# EAGLE design mainBoard1 (EAGLE 7.6.0)
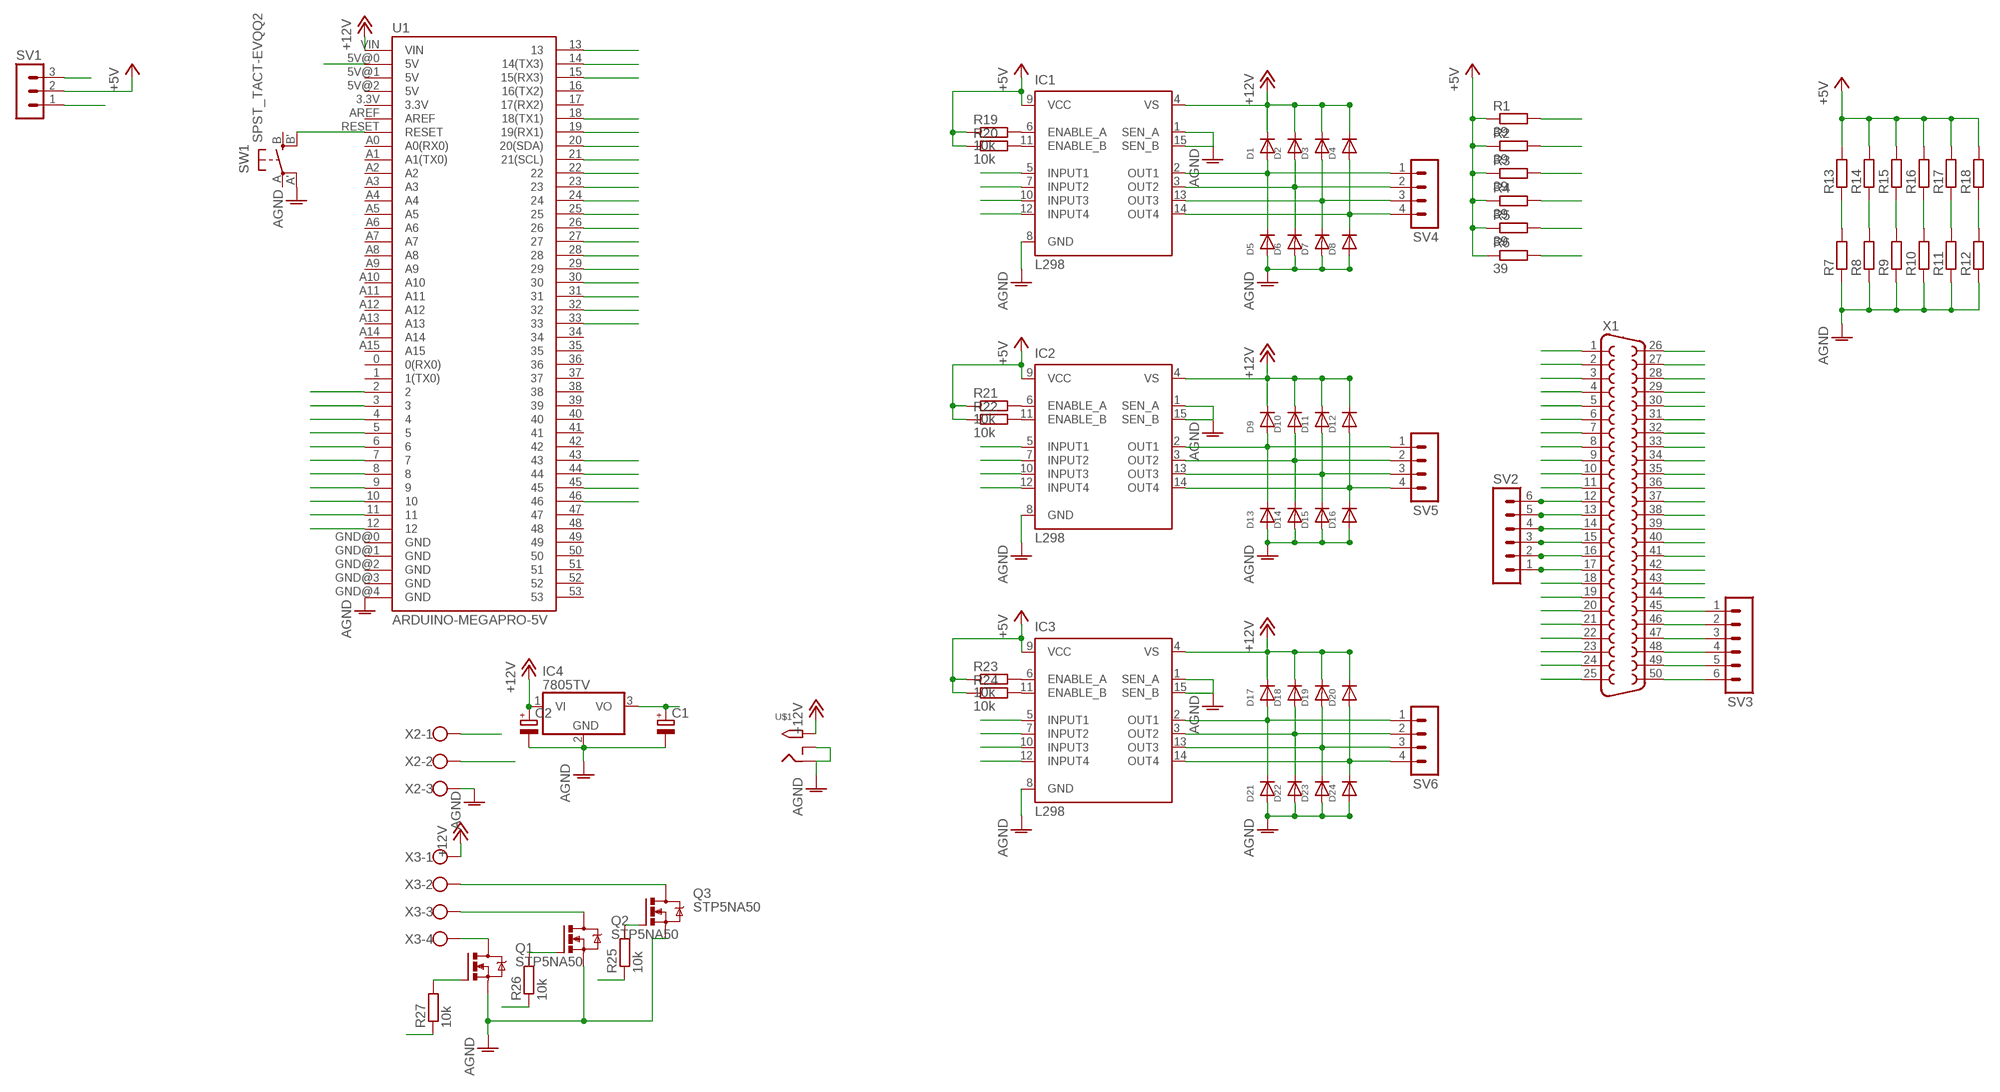
[diagram p0: schematic, sheet 1]

## Parts
C1  CPOL-EUE2,5-6E  [E2,5-6E]
C2  CPOL-EUE2,5-6E  [E2,5-6E]
D1  DIODESOD-323F  [SOD-323F]
D2  DIODESOD-323F  [SOD-323F]
D3  DIODESOD-323F  [SOD-323F]
D4  DIODESOD-323F  [SOD-323F]
D5  DIODESOD-323F  [SOD-323F]
D6  DIODESOD-323F  [SOD-323F]
D7  DIODESOD-323F  [SOD-323F]
D8  DIODESOD-323F  [SOD-323F]
D9  DIODESOD-323F  [SOD-323F]
D10  DIODESOD-323F  [SOD-323F]
D11  DIODESOD-323F  [SOD-323F]
D12  DIODESOD-323F  [SOD-323F]
D13  DIODESOD-323F  [SOD-323F]
D14  DIODESOD-323F  [SOD-323F]
D15  DIODESOD-323F  [SOD-323F]
D16  DIODESOD-323F  [SOD-323F]
D17  DIODESOD-323F  [SOD-323F]
D18  DIODESOD-323F  [SOD-323F]
D19  DIODESOD-323F  [SOD-323F]
D20  DIODESOD-323F  [SOD-323F]
D21  DIODESOD-323F  [SOD-323F]
D22  DIODESOD-323F  [SOD-323F]
D23  DIODESOD-323F  [SOD-323F]
D24  DIODESOD-323F  [SOD-323F]
IC1  L298  [MULTIWATT-15]
IC2  L298  [MULTIWATT-15]
IC3  L298  [MULTIWATT-15]
IC4  7805TV  [TO220V]
Q1  STP5NA50  [TO220BV]
Q2  STP5NA50  [TO220BV]
Q3  STP5NA50  [TO220BV]
R1  39  R0207/10  [0207/10]
R2  39  R0207/10  [0207/10]
R3  39  R0207/10  [0207/10]
R4  39  R0207/10  [0207/10]
R5  39  R0207/10  [0207/10]
R6  39  R0207/10  [0207/10]
R7  R0207/10  [0207/10]
R8  R0207/10  [0207/10]
R9  R0207/10  [0207/10]
R10  R0207/10  [0207/10]
R11  R0207/10  [0207/10]
R12  R0207/10  [0207/10]
R13  R0207/10  [0207/10]
R14  R0207/10  [0207/10]
R15  R0207/10  [0207/10]
R16  R0207/10  [0207/10]
R17  R0207/10  [0207/10]
R18  R0207/10  [0207/10]
R19  10k  R-EU_R0805  [R0805]
R20  10k  R-EU_R0805  [R0805]
R21  10k  R-EU_R0805  [R0805]
R22  10k  R-EU_R0805  [R0805]
R23  10k  R-EU_R0805  [R0805]
R24  10k  R-EU_R0805  [R0805]
R25  10k  R-EU_R0805  [R0805]
R26  10k  R-EU_R0805  [R0805]
R27  10k  R-EU_R0805  [R0805]
SV1  MA03-1  [MA03-1]
SV2  MA06-1  [MA06-1]
SV3  MA06-1  [MA06-1]
SV4  MA04-1  [MA04-1]
SV5  MA04-1  [MA04-1]
SV6  MA04-1  [MA04-1]
SW1  SPST_TACT-EVQQ2  [EVQ-Q2]
U1  ARDUINO-MEGAPRO-5V  [ARDUINO_MEGA-PRO-5V]
U$1  2.1MMJACKTHM  [PJ-102A]
X1  F50VP  [F50VP]
X2  W237-103  [W237-103]
X3  W237-4  [W237-4]

## Nets
5V_ARD: SV1.3 U1.5V@0(5V)
5V_REG: C1.+ IC4.3(VO) SV1.1 X2.1
+5V: IC1.9(VCC) IC2.9(VCC) IC3.9(VCC) R1.1 R2.1 R3.1 R4.1 R5.1 R6.1 R13.2 R14.2 R15.2 R16.2 R17.2 R18.2 R19.1 R20.1 R21.1 R22.1 R23.1 R24.1 SV1.2
+12V: C2.+ D1.C D2.C D3.C D4.C D9.C D10.C D11.C D12.C D17.C D18.C D19.C D20.C IC1.4(VS) IC2.4(VS) IC3.4(VS) IC4.1(VI) U1.VIN U$1.TIP X3.1
AGND: C1.- C2.- D5.A D6.A D7.A D8.A D13.A D14.A D15.A D16.A D21.A D22.A D23.A D24.A IC1.1(SEN_A) IC1.8(GND) IC1.15(SEN_B) IC2.1(SEN_A) IC2.8(GND) IC2.15(SEN_B) IC3.1(SEN_A) IC3.8(GND) IC3.15(SEN_B) IC4.2(GND) Q1.S Q2.S Q3.S R7.1 R8.1 R9.1 R10.1 R11.1 R12.1 SW1.A'(P1) U1.GND@4(GND) U$1.RING U$1.RING_SW X1.28 X1.29 X1.30 X1.31 X1.32 X1.33 X2.3
LED_0: R1.2 X1.11
LED_1: R2.2 X1.27
LED_2: R3.2 X1.10
LED_3: R4.2 X1.26
LED_4: R5.2 X1.9
LED_5: R6.2 X1.25
LED_B: R27.1 U1.46
LED_DATA: U1.43 X2.2
LED_G: R26.1 U1.45
LED_R: R25.1 U1.44
M1_0: D1.A D5.C IC1.2(OUT1) SV3.6 SV4.1 X1.50
M1_0_IN: IC1.5(INPUT1) U1.14(14(TX3))
M1_1: D3.A D7.C IC1.13(OUT3) SV3.5 SV4.3 X1.49
M1_1_IN: IC1.10(INPUT3) U1.4
M1_2: D9.A D13.C IC2.2(OUT1) SV3.4 SV5.1 X1.48
M1_2_IN: IC2.5(INPUT1) U1.6
M1_3: D11.A D15.C IC2.13(OUT3) SV3.3 SV5.3 X1.47
M1_3_IN: IC2.10(INPUT3) U1.8
M1_4: D17.A D21.C IC3.2(OUT1) SV3.2 SV6.1 X1.46
M1_4_IN: IC3.5(INPUT1) U1.10
M1_5: D19.A D23.C IC3.13(OUT3) SV3.1 SV6.3 X1.45
M1_5_IN: IC3.10(INPUT3) U1.12
M2_0: D2.A D6.C IC1.3(OUT2) SV2.1 SV4.2 X1.17
M2_0_IN: IC1.7(INPUT2) U1.15(15(RX3))
M2_1: D4.A D8.C IC1.14(OUT4) SV2.2 SV4.4 X1.16
M2_1_IN: IC1.12(INPUT4) U1.5
M2_2: D10.A D14.C IC2.3(OUT2) SV2.3 SV5.2 X1.15
M2_2_IN: IC2.7(INPUT2) U1.7
M2_3: D12.A D16.C IC2.14(OUT4) SV2.4 SV5.4 X1.14
M2_3_IN: IC2.12(INPUT4) U1.9
M2_4: D18.A D22.C IC3.3(OUT2) SV2.5 SV6.2 X1.13
M2_4_IN: IC3.7(INPUT2) U1.11
M2_5: D20.A D24.C IC3.14(OUT4) SV2.6 SV6.4 X1.12
M2_5_IN: IC3.12(INPUT4) U1.13
MS_0: R7.2 R13.1 U1.2 X1.23
MS_1: R8.2 R14.1 U1.3 X1.7
MS_2: R9.2 R15.1 U1.21(21(SCL)) X1.24
MS_3: R10.2 R16.1 U1.20(20(SDA)) X1.8
MS_4: R11.2 R17.1 U1.19(19(RX1)) X1.6
MS_5: R12.2 R18.1 U1.18(18(TX1)) X1.22
N$1: Q1.D X3.4
N$2: Q3.D X3.2
N$3: Q2.D X3.3
N$5: IC1.6(ENABLE_A) R19.2
N$6: IC1.11(ENABLE_B) R20.2
N$7: Q3.G R25.2
N$8: Q2.G R26.2
N$9: Q1.G R27.2
N$11: IC2.6(ENABLE_A) R21.2
N$12: IC2.11(ENABLE_B) R22.2
N$17: IC3.6(ENABLE_A) R23.2
N$18: IC3.11(ENABLE_B) R24.2
N$27: SW1.B'(S1) U1.RESET
N$44: X1.37
N$45: X1.38
N$46: X1.39
N$47: X1.40
N$48: X1.41
N$49: X1.42
N$50: X1.43
N$51: X1.44
P0_0: U1.22 X1.2
P0_1: U1.24 X1.1
P0_2: U1.26 X1.36
P0_3: U1.28 X1.35
P0_4: U1.30 X1.18
P0_5: U1.32 X1.34
P1_0: U1.23 X1.5
P1_1: U1.25 X1.21
P1_2: U1.27 X1.4
P1_3: U1.29 X1.20
P1_4: U1.31 X1.3
P1_5: U1.33 X1.19
Unconnected: SW1.A(P) SW1.B(S) U1.0(0(RX0)) U1.1(1(TX0)) U1.3.3V U1.5V@1(5V) U1.5V@2(5V) U1.16(16(TX2)) U1.17(17(RX2)) U1.34 U1.35 U1.36 U1.37 U1.38 U1.39 U1.40 U1.41 U1.42 U1.47 U1.48 U1.49 U1.50 U1.51 U1.52 U1.53 U1.A0(A0(RX0)) U1.A1(A1(TX0)) U1.A2 U1.A3 U1.A4 U1.A5 U1.A6 U1.A7 U1.A8 U1.A9 U1.A10 U1.A11 U1.A12 U1.A13 U1.A14 U1.A15 U1.AREF U1.GND@0(GND) U1.GND@1(GND) U1.GND@2(GND) U1.GND@3(GND)

## Library data of the parts
C1 C2 = rcl:CPOL-EU: POLARIZED CAPACITOR, European symbol
D1-D24 = adafruit:DIODE: Diode SMADIODE - SMA Surface Mount Package 20V 1A Schottky Diode Digikey: 641-1014-6-ND DO-1N4148 - Through Hole Small Current Diode SOD-123 20V 1 A (.5mV Vf) Schottky Diode - Digikey: MBRX120TPMSCT-ND SOD-323 10V 570mA (.38mV Vf, 3ns) Schottky Diode - Digikey: ZLLS410CT-ND SOD-523 30V 30mA Schottky Diode (RB751S-40TE61) - Digikey: RB751S-40TE61CT-ND SOT23-R/W - SOT23 Package (R = Solder Paste/Reflow Ovens, W = Hand-Soldering) BAT54Film 40V 300mA - Digikey: 497-7162-1-ND
IC1-IC3 = st-microelectronics:L298: DUAL FULL-BRIDGE DRIVER; MPN: L298N; OC_FARNELL: 1589425; OC_NEWARK: 32M1527
IC4 = linear:78*: Positive VOLTAGE REGULATOR Source: http://cache.national.com/ds/LM/LM78L05.pdf http://www.fairchildsemi.com/ds/LM/LM7805.pdf
Q1-Q3 = transistor-power:STP5NA50: N-CHANNEL MOS FET
R1-R18 = eagle-ltspice:R: RESISTOR, European symbol; SPICEMODEL: NONE; SPICEPREFIX: R
R19-R27 = rcl:R-EU_: RESISTOR, European symbol
SV1 = con-lstb:MA03-1: PIN HEADER; OC_FARNELL: unknown; OC_NEWARK: unknown
SV2 SV3 = con-lstb:MA06-1: PIN HEADER; OC_FARNELL: unknown; OC_NEWARK: unknown
SV4-SV6 = con-lstb:MA04-1: PIN HEADER; OC_FARNELL: unknown; OC_NEWARK: unknown
SW1 = adafruit:SPST_TACT: SMT 6mm switch, EVQQ2 series http://www.ladyada.net/library/eagle
U1 = SparkFun-Boards:ARDUINO-MEGA: Arduino Mega board footprint
U$1 = adafruit:2.1MMJACK: 2.1mm x 5.5mm THM DC jack with internal switch. Digikey part #PJ-102A, 4UCON part #05537 2.1mm x 5.5mm SMT DC jack with internal switch. Digikey part #PJ-002A-SMT, 4UCON part #03267 By microbuilder.eu & adafruit.com
X1 = con-subd:F50: SUB-D; OC_FARNELL: unknown; OC_NEWARK: unknown
X2 = con-wago-500:W237-103: WAGO SCREW CLAMP; MPN: 237-103; OC_FARNELL: unknown; OC_NEWARK: 18M7116
X3 = con-wago-500:W237-4: WAGO SCREW CLAMP; OC_FARNELL: unknown; OC_NEWARK: unknown

## Board
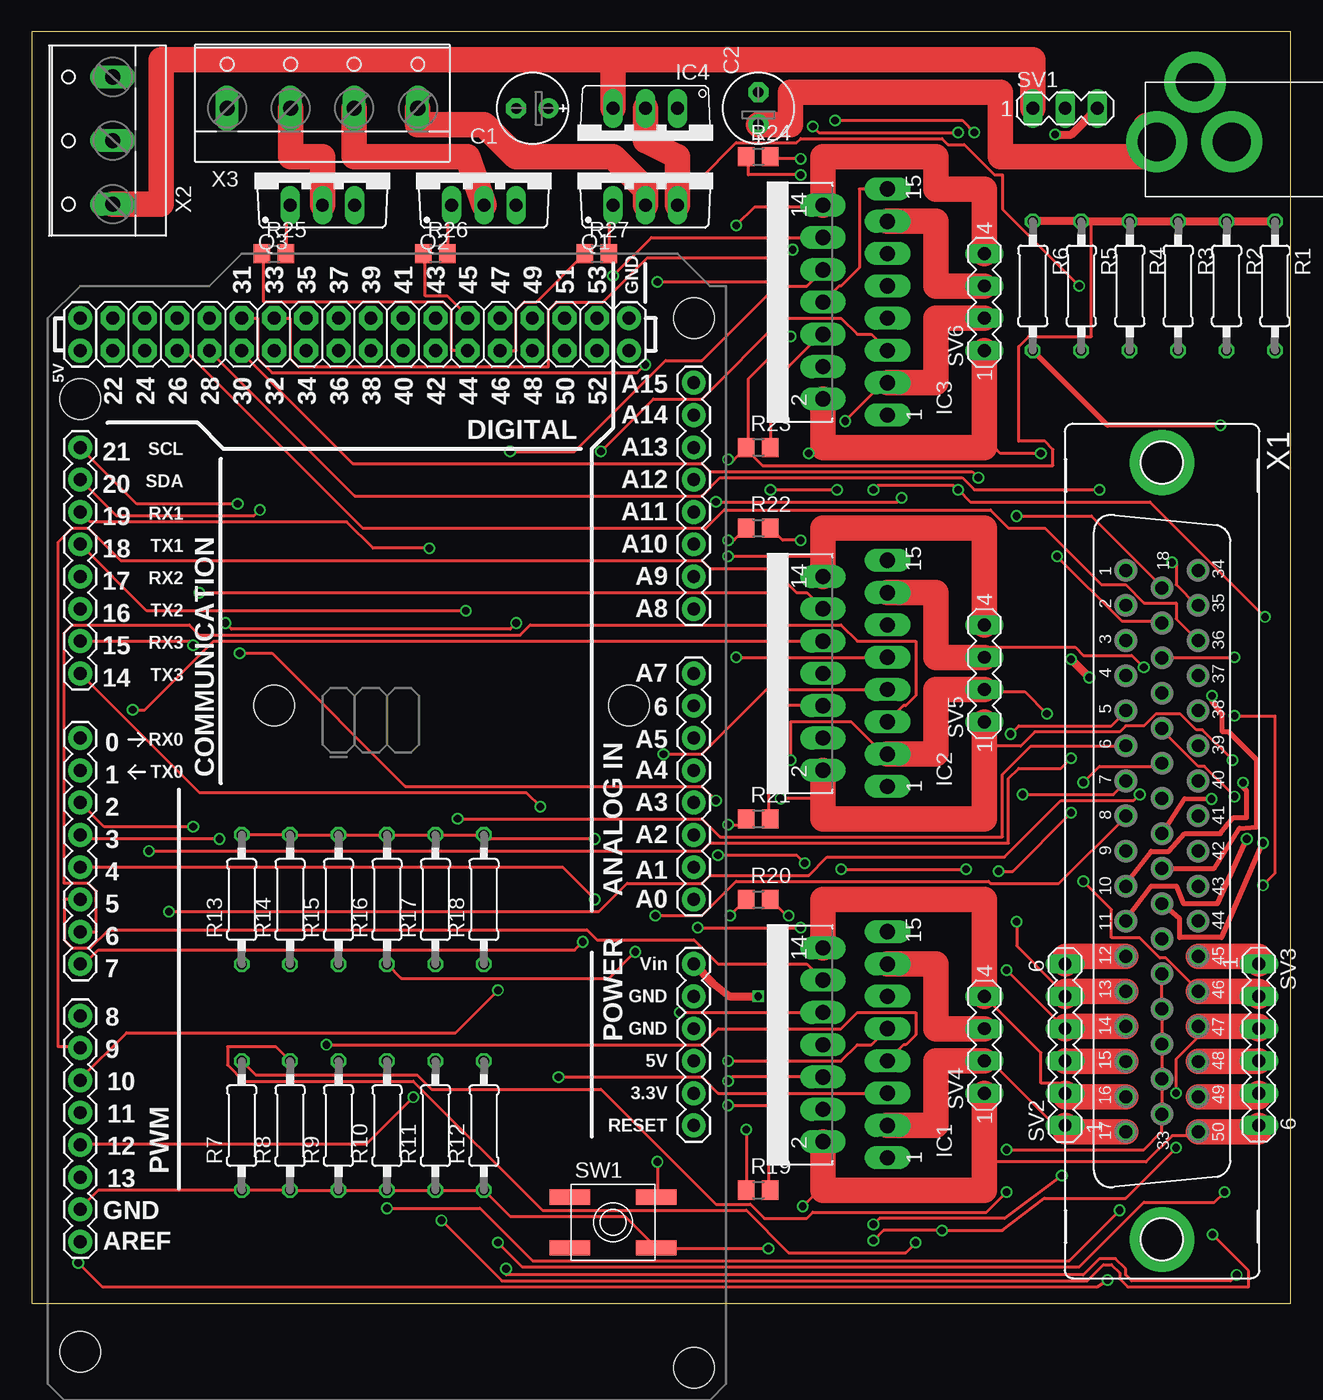
[diagram p1: board, top side]
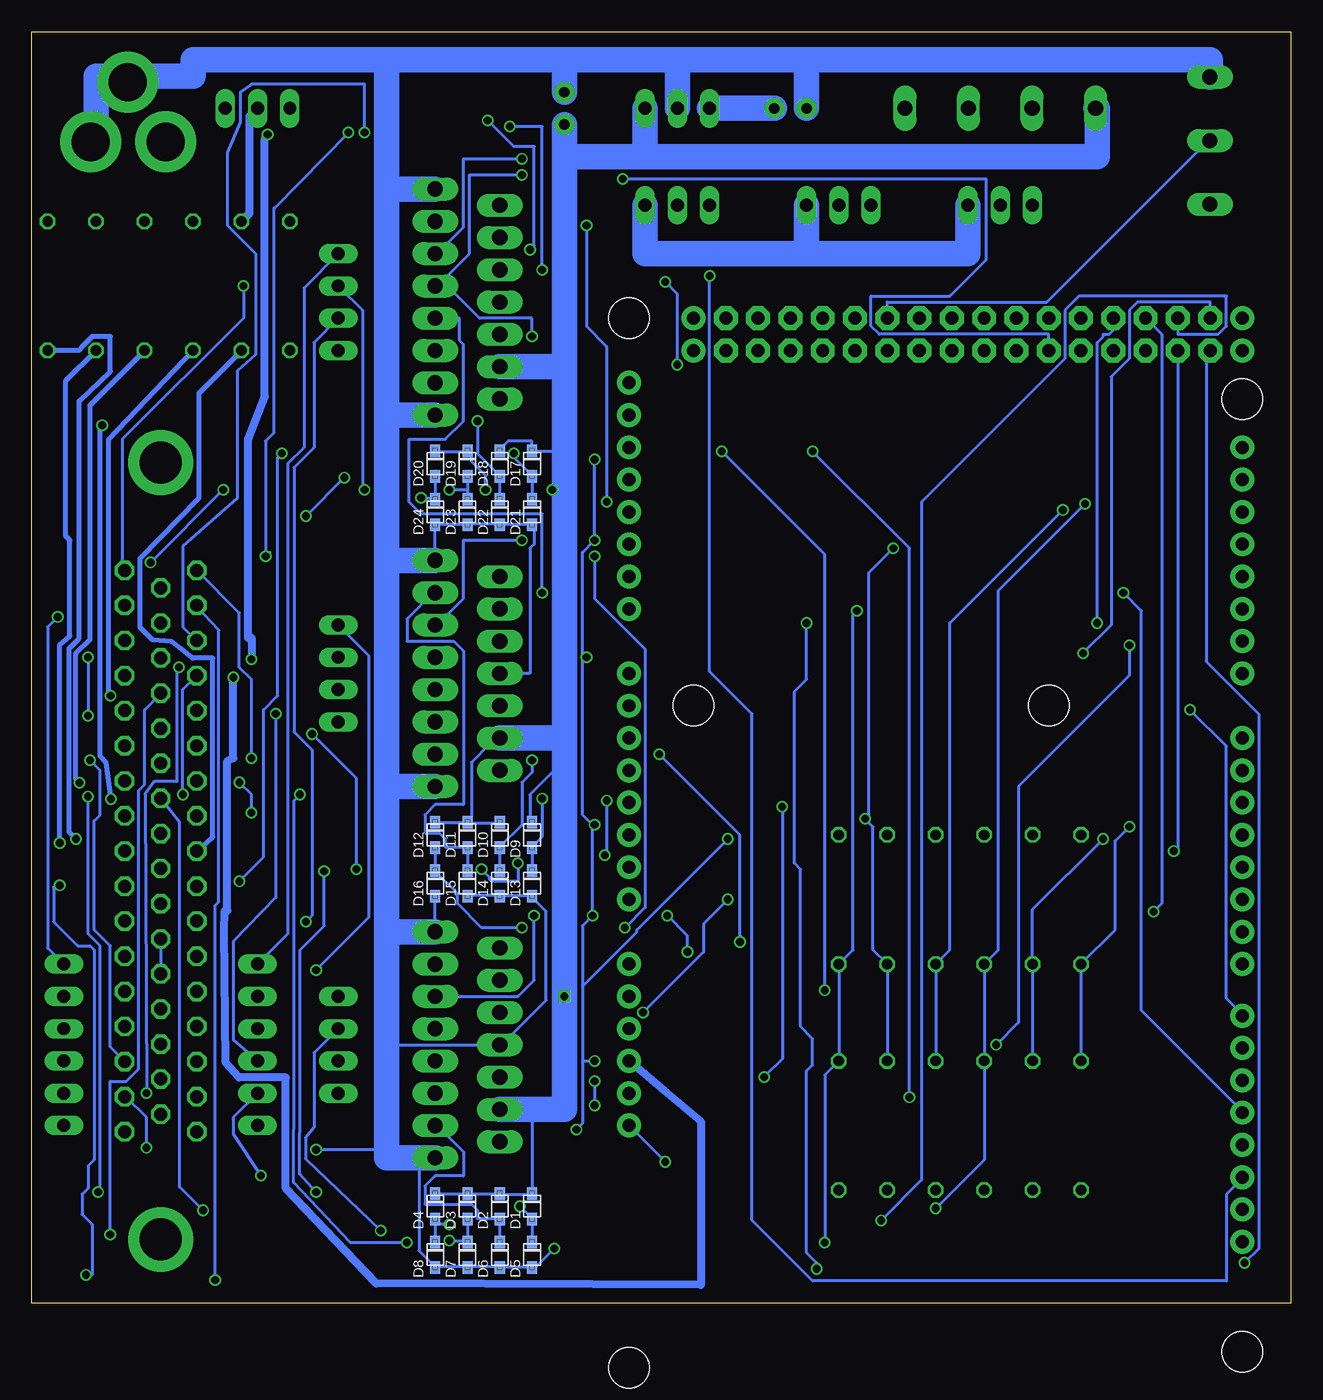
[diagram p2: board, bottom side, seen from below]

Size 99.04 x 100 mm. Coordinates in mm from the lower left corner, seen from the top.
Outline: 0,0 99.04,0 99.04,100 0,100 0,0
Copper layers (1*16): Top 0.035mm / dielectric 1.6mm / Bottom 0.035mm
Design rules "Elecrow_2-layer_PCB_eagle_rule": minimum track width 6mil, minimum drill 12mil, track to track 6mil, track to pad 6mil, pad to pad 6mil, via to via 8mil, smd to smd 0mil, copper to edge 20mil, drill to drill 10mil, minimum pad ring 6mil, minimum via ring 6mil, stop-mask expansion 0mil, vias tented up to drill 100mil, thermal gap 10mil

### Footprints (pad centres in the part's own frame; a part is rotated, then mirrored left to right if it is on the bottom)
E2,5-6E = drill 0.813 pad 1.575: + -1.27,0 | drill 0.813 pad 1.575 octagon: - 1.27,0
SOD-323F = smd 1 x 0.8: A -1,0; C 1,0
MULTIWATT-15 = drill 1.2 long: 1 -8.89,-7.62; 2 -7.62,-2.54; 3 -6.35,-7.62; 4 -5.08,-2.54; 5 -3.81,-7.62; 6 -2.54,-2.54; 7 -1.27,-7.62; 8 0,-2.54; 9 1.27,-7.62; 10 2.54,-2.54; 11 3.81,-7.62; 12 5.08,-2.54; 13 6.35,-7.62; 14 7.62,-2.54; 15 8.89,-7.62
TO220V = drill 1.016 long: 1 -2.54,-2.54; 2 0,-2.54; 3 2.54,-2.54
TO220BV = drill 1.016 long: D 0,-2.54; G -2.54,-2.54; S 2.54,-2.54
0207/10 = drill 0.813 octagon: 1 -5.08,0; 2 5.08,0
R0805 = smd 1.3 x 1.5: 1 -0.95,0; 2 0.95,0
MA03-1 = drill 1.016 long: 1 -2.54,0; 2 0,0; 3 2.54,0
MA06-1 = drill 1.016 long: 1 -6.35,0; 2 -3.81,0; 3 -1.27,0; 4 1.27,0; 5 3.81,0; 6 6.35,0
MA04-1 = drill 1.016 long: 1 -3.81,0; 2 -1.27,0; 3 1.27,0; 4 3.81,0
EVQ-Q2 = smd 3.2 x 1.2: A -3.4,-2; A' 3.4,-2; B -3.4,2; B' 3.4,2
ARDUINO_MEGA-PRO-5V = drill 1.016 pad 1.88: 0 52.07,50.8; 1 49.53,50.8; 2 46.99,50.8; 3 44.45,50.8; 3.3V 24.13,2.54; 4 41.91,50.8; 5 39.37,50.8; 5V@0 26.67,2.54; 5V@1 82.55,50.8; 5V@2 85.09,50.8; 6 36.83,50.8; 7 34.29,50.8; 8 30.226,50.8; 9 27.686,50.8; 10 25.146,50.8; 11 22.606,50.8; 12 20.066,50.8; 13 17.526,50.8; 14 57.15,50.8; 15 59.69,50.8; 16 62.23,50.8; 17 64.77,50.8; 18 67.31,50.8; 19 69.85,50.8; 20 72.39,50.8; 21 74.93,50.8; A0 39.37,2.54; A1 41.91,2.54; A2 44.45,2.54; A3 46.99,2.54; A4 49.53,2.54; A5 52.07,2.54; A6 54.61,2.54; A7 57.15,2.54; A8 62.23,2.54; A9 64.77,2.54; A10 67.31,2.54; A11 69.85,2.54; A12 72.39,2.54; A13 74.93,2.54; A14 77.47,2.54; A15 80.01,2.54; AREF 12.446,50.8; GND@0 29.21,2.54; GND@1 31.75,2.54; GND@2 82.55,7.62; GND@3 85.09,7.62; GND@4 14.986,50.8; RESET 21.59,2.54; VIN 34.29,2.54 | drill 1.016 pad 1.88 octagon: 22 82.55,48.26; 23 85.09,48.26; 24 82.55,45.72; 25 85.09,45.72; 26 82.55,43.18; 27 85.09,43.18; 28 82.55,40.64; 29 85.09,40.64; 30 82.55,38.1; 31 85.09,38.1; 32 82.55,35.56; 33 85.09,35.56; 34 82.55,33.02; 35 85.09,33.02; 36 82.55,30.48; 37 85.09,30.48; 38 82.55,27.94; 39 85.09,27.94; 40 82.55,25.4; 41 85.09,25.4; 42 82.55,22.86; 43 85.09,22.86; 44 82.55,20.32; 45 85.09,20.32; 46 82.55,17.78; 47 85.09,17.78; 48 82.55,15.24; 49 85.09,15.24; 50 82.55,12.7; 51 85.09,12.7; 52 82.55,10.16; 53 85.09,10.16 | hole 3.2: 3.81,50.8; 2.54,2.54; 54.61,35.56; 54.61,7.62; 78.74,50.8; 85.09,2.54
PJ-102A = drill 3 pad 4.8: RING 0.1,-3.39; RING_SW -4.6,-6.29; TIP 0.1,-9.29
F50VP = drill 1.016 octagon: 1 -22.073,-2.845; 2 -19.329,-2.845; 3 -16.561,-2.845; 4 -13.792,-2.845; 5 -11.049,-2.845; 6 -8.28,-2.845; 7 -5.512,-2.845; 8 -2.769,-2.845; 9 0,-2.845; 10 2.769,-2.845; 11 5.512,-2.845; 12 8.28,-2.845; 13 11.049,-2.845; 14 13.792,-2.845; 15 16.561,-2.845; 16 19.329,-2.845; 17 22.073,-2.845; 18 -20.701,0; 19 -17.932,0; 20 -15.189,0; 21 -12.421,0; 22 -9.652,0; 23 -6.909,0; 24 -4.14,0; 25 -1.372,0; 26 1.372,0; 27 4.14,0; 28 6.909,0; 29 9.652,0; 30 12.421,0; 31 15.189,0; 32 17.932,0; 33 20.701,0; 34 -22.073,2.845; 35 -19.329,2.845; 36 -16.561,2.845; 37 -13.792,2.845; 38 -11.049,2.845; 39 -8.28,2.845; 40 -5.512,2.845; 41 -2.769,2.845; 42 0,2.845; 43 2.769,2.845; 44 5.512,2.845; 45 8.28,2.845; 46 11.049,2.845; 47 13.792,2.845; 48 16.561,2.845; 49 19.329,2.845; 50 22.073,2.845 | drill 3.302 pad 5.08: G1 30.556,0; G2 -30.556,0
W237-103 = drill 1.194 long: 1 -5,-1.29; 2 0,-1.29; 3 5,-1.29
W237-4 = drill 1.194 long: 1 -7.5,-1.27; 2 -2.5,-1.27; 3 2.5,-1.27; 4 7.5,-1.27

### Placement (x,y rotation side)
C1  39.37,93.98 180 top
C2  57.15,93.98 90 top
D1  59.69,7.62 90 bottom
D2  62.23,7.62 90 bottom
D3  64.77,7.62 90 bottom
D4  67.31,7.62 90 bottom
D5  59.69,3.81 90 bottom
D6  62.23,3.81 90 bottom
D7  64.77,3.81 90 bottom
D8  67.31,3.81 90 bottom
D9  59.69,36.83 90 bottom
D10  62.23,36.83 90 bottom
D11  64.77,36.83 90 bottom
D12  67.31,36.83 90 bottom
D13  59.69,33.02 90 bottom
D14  62.23,33.02 90 bottom
D15  64.77,33.02 90 bottom
D16  67.31,33.02 90 bottom
D17  59.69,66.04 90 bottom
D18  62.23,66.04 90 bottom
D19  64.77,66.04 90 bottom
D20  67.31,66.04 90 bottom
D21  59.69,62.23 90 bottom
D22  62.23,62.23 90 bottom
D23  64.77,62.23 90 bottom
D24  67.31,62.23 90 bottom
IC1  59.69,20.32 90 top
IC2  59.69,49.53 90 top
IC3  59.69,78.74 90 top
IC4  48.26,91.44 180 top
Q1  48.26,88.9 0 top
Q2  35.56,88.9 0 top
Q3  22.86,88.9 0 top
R1  97.79,80.01 270 top
R2  93.98,80.01 270 top
R3  90.17,80.01 270 top
R4  86.36,80.01 270 top
R5  82.55,80.01 270 top
R6  78.74,80.01 270 top
R7  16.51,13.97 90 top
R8  20.32,13.97 90 top
R9  24.13,13.97 90 top
R10  27.94,13.97 90 top
R11  31.75,13.97 90 top
R12  35.56,13.97 90 top
R13  16.51,31.75 90 top
R14  20.32,31.75 90 top
R15  24.13,31.75 90 top
R16  27.94,31.75 90 top
R17  31.75,31.75 90 top
R18  35.56,31.75 90 top
R19  57.15,8.89 0 top
R20  57.15,31.75 0 top
R21  57.15,38.1 0 top
R22  57.15,60.96 0 top
R23  57.15,67.31 0 top
R24  57.15,90.17 0 top
R25  19.05,82.55 0 top
R26  31.75,82.55 0 top
R27  44.45,82.55 0 top
SV1  81.28,93.98 0 top
SV2  81.28,20.32 90 top
SV3  96.52,20.32 270 top
SV4  74.93,20.32 90 top
SV5  74.93,49.53 90 top
SV6  74.93,78.74 90 top
SW1  45.72,6.35 0 top
U1  54.61,-7.62 90 top
U$1  97.79,91.44 270 top
X1  88.9,35.56 270 top
X2  5.08,91.44 90 top
X3  22.86,95.25 0 top

### Tracks (layer width: path | path; a pad name or v marks a point on that pad's centre or on a via)
5V_ARD  (via drill 0.61)
  Top 0.635: SV1.3 81.76,91.92 v80.49,91.92 | v83.19,49.21 v81.76,50.64
  Bottom 0.635: v80.49,91.92 80.71,91.57 80.71,71.31 82.01,67.98 82.04,67.98 82.04,52.32 81.76,52.32 v81.76,50.64 | v83.19,49.21 83.19,42.86 83.66,42.64 83.66,30.86 83.85,30.86 83.92,29.27 83.79,18.92 82.74,17.75 79.06,17.75 79.06,9.05 71.94,1.56 46.42,1.43 46.42,14.29 49.28,16.7 U1.5V@0
5V_REG
  Top 2: X2.1 10.16,86.44 10.16,97.79 45.72,97.79 | 45.72,97.79 IC4.3 | SV1.1 78.74,97.79 45.72,97.79
  Bottom 2: C1.+ IC4.3
+5V  (via drill 0.61)
  Top 0.254: v60.48,88.74 56.36,88.74 56.36,90.17 R24.1 | R13.2 R14.2 R15.2 R16.2 R17.2 R18.2 35.88,36.51 v44.29,36.51 | v56.2,13.65 R19.1 | v54.93,30.48 R20.1 | v54.77,37.62 55.72,37.62 R21.1 | v54.77,60.01 55.24,60.01 R22.1 | v54.77,66.36 55.24,66.36 R23.1 | IC1.9 66.04,20.32 64.93,20.32 63.66,19.05 v54.77,19.05 | v55.4,50.8 IC2.9 | v59.69,76.04 56.36,72.71 56.36,67.31 R23.1 | 83.34,85.09 83.34,76.04 78.42,76.04 77.63,75.25 77.63,67.79 79.69,67.79 80.33,67.15 80.33,65.88 57.47,65.88 56.2,67.15 R23.1
  Top 0.635: R6.1 R5.1 83.34,85.09 R4.1 R3.1 R2.1 R1.1
  Bottom 0.254: v60.48,88.74 64.61,88.74 64.61,82.55 67.15,80.01 IC3.9 66.67,80.33 63.82,77.47 59.69,77.47 v59.69,76.04 | v56.2,13.65 55.72,14.13 55.72,19.05 | 55.72,24.92 55.72,29.69 v54.93,30.48 54.93,37.47 v54.77,37.62 54.93,37.62 55.72,38.42 55.72,50.8 | 55.72,24.92 55.72,19.05 | 55.72,50.8 55.72,59.05 v54.77,60.01 v54.77,66.36 | 55.72,19.05 v54.77,19.05 | 55.72,50.8 v55.4,50.8 | v44.29,36.51 51.44,29.37 51.44,29.21 55.72,24.92
  Bottom 0.635: SV1.2 81.92,93.34 81.92,85.72 R5.1
+12V  (via drill 0.6, 0.61)
  Top 0.254: v58.1,63.98 v63.34,63.98
  Top 0.635: U1.VIN 53.59,25.15 54.86,24.13 v57.15,24.13
  Top 2: U$1.TIP 87.63,92.61 87.63,90.17 76.2,90.17 76.2,95.25 59.69,95.25 59.69,92.71 C2.+
  Bottom 0.254: 62.23,8.57 59.69,8.57 D1.C 59.69,15.24 | 62.23,8.57 64.77,8.57 | 62.23,8.57 D2.C | 64.77,8.57 67.31,8.57 D4.C | 64.77,8.57 D3.C | 64.77,37.78 62.23,37.78 D10.C | 64.77,37.78 67.31,37.78 D12.C | 64.77,37.78 D11.C 64.77,37.94 64.45,38.26 64.45,42.55 63.02,43.97 IC2.4 | 64.77,66.99 67.31,66.99 D20.C | D9.C 59.69,37.94 59.85,38.1 59.85,40.01 58.1,41.75 57.15,41.75 | 57.15,66.99 59.69,66.99 D17.C 59.69,67.79 61.59,67.79 62.23,67.15 D18.C | 64.77,66.99 64.45,66.67 64.45,66.2 63.34,65.09 v63.34,63.98 | 64.77,66.99 D19.C | v58.1,63.98 57.15,63.98
  Bottom 2: 57.15,73.66 57.15,66.99 57.15,63.98 57.15,44.45 | 57.15,44.45 57.15,41.75 v57.15,24.13 57.15,15.24 59.69,15.24 IC1.4 | 50.8,90.17 57.15,90.17 | IC2.4 57.15,44.45 | IC3.4 57.15,73.66 | 50.8,90.17 IC4.1 | X3.1 15.24,93.98 15.24,90.17 50.8,90.17 | 57.15,73.66 57.15,90.17 | C2.+ 57.15,90.17
AGND  (via drill 0.61)
  Top 0.254: U1.GND@4 3.81,7.46 5.24,8.89 R7.1 R8.1 R9.1 R10.1 R11.1 R12.1 37.62,6.83 46.67,6.83 49.05,4.45 SW1.A' 49.21,4.29 v57.94,4.29 | X1.29 X1.30 X1.31 X1.32 X1.33 88.9,13.49 87.47,12.06 v76.68,12.06 | IC3.8 63.5,80.01 63.66,80.01 65.09,81.44 65.09,87.63 IC3.15
  Top 2: Q1.S 50.8,90.17 48.26,91.44 IC4.2
  Bottom 0.254: X1.28 X1.29 | 62.23,32.07 59.69,32.07 D13.A 59.69,31.91 58.58,30.8 58.58,23.81 62.07,20.32 IC1.8 71.12,20.32 | 62.23,32.07 64.77,32.07 D15.A | 62.23,32.07 D14.A | 62.23,2.86 59.69,2.86 | 62.23,2.86 64.77,2.86 | 62.23,2.86 D6.A | 64.77,2.86 67.31,2.86 | 64.77,2.86 D7.A | 62.23,61.28 59.69,61.28 D21.A 59.69,61.12 59.53,60.96 59.53,59.69 59.85,59.37 59.85,49.53 IC2.8 | 62.23,61.28 64.77,61.28 | 62.23,61.28 D22.A | IC1.15 D16.A | IC2.15 D24.A 67.31,61.28 64.77,61.28 | 64.77,61.28 D23.A | 67.31,2.86 68.58,4.13 68.58,11.43 | 67.31,2.86 D8.A | 71.12,12.06 v76.68,12.06 | v57.94,4.29 59.37,2.86 59.69,2.86 | 59.69,2.86 D5.A
  Bottom 2: 71.12,97.79 71.12,87.63 | 71.12,87.63 71.12,69.85 | 71.12,69.85 71.12,58.42 | 71.12,58.42 71.12,40.64 | 71.12,40.64 71.12,29.21 | 71.12,29.21 71.12,20.32 71.12,12.06 71.12,11.43 68.58,11.43 IC1.1 | IC2.15 71.12,58.42 | IC3.15 71.12,87.63 | IC3.1 71.12,69.85 | IC2.1 71.12,40.64 | IC1.15 71.12,29.21 | 71.12,97.79 57.15,97.79 | 57.15,97.79 48.26,97.79 | 48.26,97.79 IC4.2 | X2.3 6.35,96.44 6.35,97.79 38.1,97.79 | 38.1,97.79 48.26,97.79 | Q3.S 25.4,82.55 38.1,82.55 | 38.1,82.55 50.8,82.55 Q1.S | Q2.S 38.1,82.55 | C2.- 57.15,97.79 | C1.- 38.1,97.79 | U$1.RING 93.98,91.34 93.98,96.52 91.5,96.52 | 91.5,96.52 U$1.RING_SW | 91.5,96.52 86.36,96.52 86.36,97.79 71.12,97.79
LED_0  (via drill 0.61)
  Top 0.254: 86.04,30.16 X1.11
  Top 0.381: v95.57,36.51 93.28,31.43 90.58,31.43 90.04,32.8 88.04,32.8 86.04,30.16
  Bottom 0.381: R1.2 95.34,74.93 95.09,75.25 94.3,76.04 92.87,76.04 92.87,73.28 95.31,70.96 95.31,52.29 96.11,51.5 96.11,37.05 v95.57,36.51
LED_1  (via drill 0.61)
  Top 0.254: 88.9,31.43 X1.27
  Top 0.381: v96.84,36.2 93.6,28.77 90.3,28.77 90.3,30.23 X1.27
  Bottom 0.381: R2.2 96.36,72.55 96.36,60.33 96.04,60.01 96.04,52.48 96.84,51.82 v96.84,36.2
LED_2  (via drill 0.61)
  Top 0.254: 86.2,33.18 86.2,32.86 X1.10
  Top 0.381: v95.28,40.93 95.28,40.58 95.57,40.29 95.57,38.2 94.52,38.2 93.5,36.92 90.71,36.92 89.44,35.53 88.04,35.53 86.2,33.18
  Bottom 0.381: R3.2 94.46,70.64 94.46,52.23 95.57,51.12 95.57,41.21 v95.28,40.93
LED_3  (via drill 0.61)
  Top 0.254: 88.9,34.29 X1.26
  Top 0.381: v92.84,47.78 92.84,47.31 93.66,46.35 93.66,44.93 94.14,44.93 96.36,42.7 96.36,37.47 95,37.34 93,34.2 89.31,34.2 88.9,34.29
  Bottom 0.381: R4.2 93,67.91 93,48.07 v92.84,47.78
LED_4
  Bottom 0.254: 86.04,35.56 X1.9
  Bottom 0.381: R5.2 85.88,71.6 85.88,63.34 90.52,58.58 90.52,53.15 89.53,52.16 88.04,52.04 87.28,51.47 86.42,50.74 84.8,50.74 84.8,36.67 86.04,35.56
LED_5  (via drill 0.61)
  Top 0.254: 88.9,36.99 X1.25
  Top 0.381: R6.2 84.61,69.06 v93.5,69.06 | v92.81,39.66 90.68,39.69 89.06,37.15 88.9,36.99
  Bottom 0.254: 93.66,68.9 v93.5,69.06
  Bottom 0.381: 93.66,68.9 93.66,43.02 93.19,42.55 v92.81,39.66
LED_B
  Top 0.254: U1.46 38.1,74.93 38.1,78.11 38.73,78.74 39.69,78.74 R27.1
LED_DATA
  Bottom 0.254: U1.43 31.75,78.74 19.21,78.74 6.51,91.44 X2.2
LED_G
  Top 0.254: U1.45 34.29,77.63 32.7,79.22 30.96,79.22 30.96,82.55 R26.1
LED_R
  Top 0.254: U1.44 33.02,74.93 33.02,78.11 32.38,78.74 18.26,78.74 18.26,82.55 R25.1
M1_0  (via drill 0.61)
  Top 0.254: v60.64,7.62 61.44,8.41 62.23,8.89 | 74.93,11.11 87.63,11.11 89.69,13.18 90.81,13.18 X1.50
  Top 2: SV4.1 74.93,11.11 74.93,8.89 62.23,8.89 IC1.2 | X1.50 96.52,13.49 SV3.6
  Bottom 0.254: D5.C D1.A 59.69,6.67 v60.64,7.62
M1_0_IN  (via drill 0.61)
  Top 0.254: IC1.5 53.98,16.51 52.7,17.78 v41.43,17.78 | v40.01,39.05 38.89,40.16 13.18,40.16 U1.14
  Bottom 0.254: v41.43,17.78 40.01,19.21 v40.01,39.05
M1_1  (via drill 0.61)
  Top 0.254: v66.2,4.92 66.99,5.71 v71.6,5.71 76.36,5.71 79.66,8.26 86.04,8.26 v90.01,12.22
  Top 2: SV4.3 71.12,21.59 71.12,26.67 IC1.13 | X1.49 96.52,16.23 SV3.5
  Bottom 0.254: D3.A 64.77,4.92 | v66.2,4.92 64.77,4.92 | v71.6,5.71 77.5,11.37 77.5,13.02 76.83,13.81 76.83,19.68 SV4.3 | 64.77,4.92 D7.C | v90.01,12.22 90.01,14.61 91.6,16.19 X1.49
M1_1_IN  (via drill 0.61)
  Top 0.254: v50.96,22.86 IC1.10 | v44.29,31.75 41.75,34.29 U1.4
  Bottom 0.254: v50.96,22.86 46.2,27.62 46.2,29.84 v44.29,31.75
M1_2  (via drill 0.61)
  Top 0.254: 62.23,39.69 v58.9,39.69 | 74.93,43.81 77.79,43.81 78.9,44.93 85.57,44.93 86.04,45.4 87.47,45.4 88.42,46.35 90.33,46.35 91.6,45.09 92.08,45.09 v94.46,42.7
  Top 2: SV5.1 74.93,43.81 74.93,38.1 62.23,38.1 62.23,39.69 IC2.2 | X1.48 96.52,19 SV3.4
  Bottom 0.254: D13.C D9.A 59.69,35.88 58.9,36.67 v58.9,39.69 | v94.46,42.7 93.66,41.91 93.66,38.42 94.14,37.94 94.14,29.37 92.87,28.1 92.87,20.16 91.76,19.05 X1.48
M1_2_IN
  Top 0.254: IC2.5 68.58,46.99 68.74,46.99 69.53,47.78 69.53,52.07 64.93,52.07 63.66,53.34 39.21,53.34 38.42,52.55 13.18,52.55 12.38,53.34 3.17,53.34 2.54,52.7 2.54,33.02 4.45,33.02 5.08,32.38 5.08,29.21 U1.6
M1_3  (via drill 0.61)
  Top 0.254: v90.01,16.51 90.01,19.21 91.6,20.8 X1.47 | v87.47,50.01 86.52,50.96 82.71,50.96 82.07,51.59 75.41,51.59 SV5.3
  Top 2: SV5.3 71.12,50.8 71.12,55.88 IC2.13 | X1.47 96.52,21.77 SV3.3
  Bottom 0.254: D15.C D11.A 64.77,35.88 66.52,35.88 66.52,36.51 66.99,36.99 68.1,36.99 68.1,38.42 67.31,39.21 65.09,39.21 65.09,51.28 65.88,52.07 69.53,52.07 69.53,53.82 67.47,55.88 IC2.13 | v90.01,16.51 90.14,40.04 89.41,41.02 87.63,41.02 87.63,49.85 v87.47,50.01
M1_3_IN  (via drill 0.61)
  Top 0.254: IC2.10 14.29,52.07 8.89,46.67 v7.94,46.67
  Bottom 0.254: v7.94,46.67 5.08,43.81 5.08,23.97 3.81,22.7 U1.8
M1_4  (via drill 0.61)
  Top 0.254: v61.12,66.83 61.44,66.83 62.23,67.31 | v79.38,66.83 76.2,66.83 75.88,67.15 74.93,67.31 | v82.71,33.18 84.93,30.96 84.93,28.73 87.15,28.73 88.74,27.15 89.22,27.15 91.12,25.24 X1.46
  Top 2: X1.46 96.52,24.51 SV3.2 | SV6.1 74.93,67.31 62.23,67.31 IC3.2
  Bottom 0.254: D21.C D17.A 59.69,65.09 61.12,66.52 v61.12,66.83 | v79.38,66.83 79.69,66.52 79.69,47.78 80.8,46.67 80.8,35.08 v82.71,33.18
M1_4_IN  (via drill 0.61)
  Top 0.254: IC3.5 66.04,76.2 64.93,76.2 63.66,77.47 59.05,77.47 52.7,71.12 48.9,71.12 v44.77,66.99 | v36.67,24.61 33.34,21.27 7.46,21.27 3.81,17.62 U1.10
  Bottom 0.254: v44.77,66.99 36.67,58.9 v36.67,24.61
M1_5  (via drill 0.61)
  Top 0.254: v66.2,63.98 66.52,64.29 72.55,64.29 v72.87,63.98 73.82,63.02 87.95,63.02 v97,53.98
  Top 2: X1.45 96.52,27.28 SV3.1 | SV6.3 71.12,80.01 71.12,85.09 IC3.13
  Bottom 0.254: D19.A 64.77,63.98 | 64.77,63.98 D23.C | v66.2,63.98 64.77,63.98 | v72.87,63.98 73.03,64.14 73.03,78.11 SV6.3 | SV3.1 97.79,27.94 97.79,53.18 v97,53.98
M1_5_IN  (via drill 0.61)
  Top 0.254: IC3.10 60.96,80.01 58.58,80.01 52.7,74.14 49.85,74.14 42.7,66.99 v37.62,66.99 | v30,16.19 26.35,12.54 3.81,12.54 U1.12
  Bottom 0.254: v37.62,66.99 30,59.37 v30,16.19
M2_0
  Top 0.254: SV2.1 80.33,14.13 75.88,18.57 75.72,18.57 SV4.2
  Top 2: SV4.2 71.12,19.05 71.12,13.97 IC1.3 | X1.17 81.28,13.49 SV2.1
  Bottom 0.254: D6.C D2.A 62.23,6.67 63.98,6.67 63.98,7.3 64.45,7.78 68.1,7.78 68.1,9.21 67.31,10 65.09,10 65.09,11.91 67.15,13.97 IC1.3
M2_0_IN  (via drill 0.61)
  Top 0.254: IC1.7 68.58,20.32 68.74,20.32 69.53,21.11 69.53,22.86 64.93,22.86 63.66,21.59 53.98,21.59 52.7,20.32 v23.18,20.32 | v12.7,51.75 12.38,52.07 U1.15
  Bottom 0.254: v23.18,20.32 21.43,22.07 21.43,40.64 12.7,49.37 v12.7,51.75
M2_1  (via drill 0.61)
  Top 0.254: v66.2,6.19 66.67,6.67 76.52,6.67 v81.03,10.03 | SV4.4 79.38,19.68 79.38,17.3 80.8,17.3 SV2.2
  Top 2: SV4.4 74.93,31.75 62.23,31.75 IC1.14 | X1.16 81.28,16.23 SV2.2
  Bottom 0.254: 67.31,6.19 D4.A 67.31,6.51 | 67.31,6.19 D8.C | v66.2,6.19 67.31,6.19 | v81.03,10.03 83.19,13.34 83.19,14.61 SV2.2
M2_1_IN
  Top 0.254: IC1.12 60.96,26.67 53.98,26.67 52.07,28.57 44.45,28.57 43.66,29.37 6.03,29.37 4.6,27.94 3.17,27.94 2.54,28.57 2.54,31.75 U1.5
M2_2  (via drill 0.61)
  Top 0.254: v59.69,42.7 59.69,45.72 64.45,45.72 66.52,43.66 IC2.3 | v79.85,46.35 78.11,48.1 75.88,48.1 SV5.2
  Top 2: SV5.2 71.12,48.26 71.12,43.18 IC2.3 | X1.15 81.28,19 SV2.3
  Bottom 0.254: D14.C D10.A 62.23,35.88 60.48,37.62 60.48,40.96 59.69,41.75 v59.69,42.7 | SV2.3 83.19,20.7 83.19,28.45 79.85,31.91 v79.85,46.35
M2_2_IN  (via drill 0.61)
  Top 0.254: IC2.7 57.78,48.26 52.7,43.18 v49.69,43.18 | v43.34,28.42 42.7,27.78 5.24,27.78 4.13,26.67 U1.7
  Bottom 0.254: v49.69,43.18 43.34,36.83 v43.34,28.42
M2_3  (via drill 0.61)
  Top 0.254: v52.39,29.53 v60.48,29.53 | 62.23,58.74 v54.77,58.74 | v76.68,26.19 80.49,22.38 81.28,21.77
  Top 2: SV5.4 74.93,60.96 62.23,60.96 62.23,58.74 IC2.14 | X1.14 81.28,21.77 SV2.4
  Bottom 0.254: D12.A D16.C 67.31,33.97 65.56,32.23 65.56,31.43 63.66,29.53 v60.48,29.53 | v52.39,29.53 50.8,31.11 50.8,51.44 54.77,55.4 v54.77,58.74 | v76.68,26.19 72.55,30.32 72.55,50.96 SV5.4
M2_3_IN
  Top 0.254: IC2.12 60.96,55.88 60.17,55.88 58.26,57.78 53.34,57.78 52.7,58.42 6.99,58.42 4.45,60.96 3.17,60.96 2.06,59.85 2.06,20.16 3.81,20.16 U1.9
M2_4  (via drill 0.61)
  Top 0.254: v63.98,69.37 66.52,71.91 IC3.3 | v77.47,30 77.47,28.1 80.49,25.08 81.28,24.51
  Top 2: X1.13 81.28,24.51 SV2.5 | SV6.2 71.12,77.47 71.12,72.39 IC3.3
  Bottom 0.254: D22.C D18.A 62.23,65.09 63.98,66.83 v63.98,69.37 | v77.47,30 76.99,30.48 76.99,43.5 78.42,44.93 78.42,65.72 76.83,67.31 76.83,75.56 SV6.2
M2_4_IN  (via drill 0.61)
  Top 0.254: v13.18,55.88 v58.9,55.88
  Bottom 0.254: IC3.7 65.41,77.47 65.41,75.72 65.09,75.41 65.09,69.37 66.52,67.94 69.37,67.94 69.37,63.02 68.42,62.07 58.9,62.07 v58.9,55.88 | v13.18,55.88 11.75,54.45 11.75,23.02 3.81,15.08 U1.11
M2_5  (via drill 0.61)
  Top 0.254: v68.42,63.34 68.1,63.02 v53.82,63.02 | v55.4,84.77 56.83,86.2 61.28,86.2 IC3.14
  Top 2: X1.12 81.28,27.28 SV2.6 | SV6.4 74.93,87.63 71.12,87.63 71.12,90.17 62.23,90.17 IC3.14
  Bottom 0.254: D20.A 67.31,63.34 | v68.42,63.34 67.31,63.34 | v53.82,63.02 53.82,75.25 55.4,76.83 v55.4,84.77 | 67.31,63.34 D24.C | SV2.6 78.9,29.05 78.9,66.04 77.63,67.31 77.63,79.85 SV6.4
M2_5_IN  (via drill 0.61)
  Top 0.254: IC3.12 48.74,83.82 v45.72,80.8
  Bottom 0.254: v45.72,80.8 45.72,49.69 42.39,46.35 42.39,6.51 37.62,1.75 5.08,1.75 5.08,8.57 3.81,9.84 U1.13
MS_0  (via drill 0.61)
  Top 0.254: v82.71,40.96 83.98,42.23 88.74,42.23 88.9,42.39 X1.23 | v81.76,38.58 77.15,33.97 v76.04,33.97 | v76.68,8.73 75.09,7.14 61.44,7.14 60.96,6.67 57.63,6.67 56.52,7.78 53.82,7.78 44.77,16.83 31.43,16.83 30.32,17.94 17.62,17.94 R7.2 | U1.2 5.71,37.47 v12.7,37.47
  Bottom 0.254: R7.2 R13.1 13.81,29.37 13.81,36.35 v12.7,37.47 | v82.71,40.96 81.76,40.01 v81.76,38.58 | v76.04,33.97 76.04,29.69 77.95,27.78 77.95,13.49 77.98,13.34 77.98,10.16 v76.68,8.73
MS_1  (via drill 0.61)
  Top 0.254: v77.95,40.01 85.09,40.01 86.04,40.96 X1.7 | v69.53,4.76 68.74,3.97 59.53,3.97 56.2,7.3 40.16,7.3 30,17.46 16.67,17.46 15.4,18.73 15.4,20.16 19.21,20.16 R8.2 | U1.3 4.13,36.51 v14.76,36.51
  Bottom 0.254: R8.2 R14.1 20.32,30.96 v14.76,36.51 | v77.95,40.01 78.42,39.53 78.42,13.81 78.45,13.53 78.45,9.49 73.98,4.76 v69.53,4.76
MS_2  (via drill 0.61)
  Top 0.254: v85.57,7.3 81.6,3.33 39.37,3.33 35.24,7.46 v27.94,7.46 | U1.21 8.26,62.87 v16.19,62.87
  Bottom 0.254: v85.57,7.3 87.41,9.14 87.41,37.81 88.9,39.69 X1.24 | v27.94,7.46 24.13,11.27 R9.2 R15.1 23.02,27.78 23.02,56.04 v16.19,62.87
MS_3  (via drill 0.61)
  Top 0.254: v49.05,30.48 52.7,30.48 55.4,33.18 75.25,33.18 75.41,33.02 80.8,33.02 86.04,38.26 X1.8 | v47.47,27.62 45.4,25.56 29.05,25.56 R16.1 | U1.20 6.67,61.91 17.46,61.91 v17.94,62.39
  Bottom 0.254: R10.2 R16.1 26.83,27.78 26.83,53.5 v17.94,62.39 | v49.05,30.48 47.47,28.89 v47.47,27.62
MS_4  (via drill 0.61)
  Top 0.254: v33.5,38.1 52.7,38.1 54.13,36.67 76.36,36.67 76.36,41.59 78.58,43.81 86.04,43.81 X1.6 | U1.19 4.6,61.44 24.77,61.44 26.83,59.37 v31.27,59.37
  Bottom 0.254: R11.2 R17.1 32.86,27.78 32.86,37.47 v33.5,38.1 33.18,37.94 33.18,57.47 v31.27,59.37
MS_5  (via drill 0.61)
  Top 0.254: v94.61,39.85 92.23,42.23 91.76,42.23 88.9,45.09 X1.22 | v93.82,8.73 93.03,7.94 87.47,7.94 82.39,2.86 38.58,2.86 v36.67,4.76 | U1.18 9.05,54.45 v34.13,54.45
  Bottom 0.254: v94.61,39.85 94.61,29.05 93.66,28.1 93.66,8.89 v93.82,8.73 | v36.67,4.76 36.67,17.94 R12.2 R18.1 34.45,27.78 34.45,54.13 v34.13,54.45
N$1
  Top 2: Q1.D 48.26,87.63 45.72,90.17 38.1,90.17 35.56,92.71 30.36,92.71 X3.4
N$2
  Top 2: Q3.D 22.86,90.17 20.36,90.17 X3.2
N$3
  Top 2: Q2.D 34.29,90.17 25.36,90.17 X3.3
N$5  (via drill 0.61)
  Top 0.254: v54.77,15.56 57.94,15.56 57.94,8.89 R19.2 | v54.77,17.46 55.09,17.78 IC1.6
  Bottom 0.254: v54.77,17.46 v54.77,15.56
N$6  (via drill 0.61)
  Top 0.254: v59.53,30.48 59.37,30.48 R20.2
  Bottom 0.254: v59.53,30.48 59.53,25.4 60.8,24.13 IC1.11
N$7
  Top 0.254: Q3.G 20,86.36 R25.2
N$8
  Top 0.254: Q2.G 32.7,86.36 R26.2
N$9
  Top 0.254: Q1.G 45.4,86.36 R27.2
N$11
  Top 0.254: IC2.6 57.94,46.99 57.94,38.1 R21.2
N$12  (via drill 0.61)
  Top 0.254: v60.48,60.01 59.05,60.01 R22.2
  Bottom 0.254: v60.48,60.01 65.09,60.01 65.09,55.4 67.15,53.34 IC2.11
N$17
  Top 0.254: IC3.6 62.07,76.2 59.53,73.66 58.1,73.66 R23.2
N$18  (via drill 0.61)
  Top 0.254: v60.48,90.01 58.26,90.01 R24.2
  Bottom 0.254: v60.48,90.01 65.09,90.01 65.09,84.61 67.15,82.55 IC3.11
N$27  (via drill 0.61)
  Top 0.254: v49.21,11.11 49.21,8.41 SW1.B'
  Bottom 0.254: U1.RESET v49.21,11.11
P0_0  (via drill 0.61)
  Top 0.254: v84.61,1.81 83.82,1.27 5.56,1.27 v3.65,3.17
  Bottom 0.254: v84.61,1.81 84.61,31.27 84.33,31.56 84.33,52.93 86.04,54.77 X1.2 | v3.65,3.17 2.54,4.29 2.54,46.35 6.67,50.48 6.67,74.61 U1.22
P0_1  (via drill 0.61)
  Top 0.254: v81.76,42.86 80.96,42.07 77.63,42.07 76.83,41.27 76.83,36.2 53.34,36.2 52.7,35.56 v9.21,35.56
  Bottom 0.254: v81.76,42.86 81.76,49.05 82.71,50.01 82.71,54.29 86.04,57.63 X1.1 | v9.21,35.56 8.89,35.88 U1.24
P0_2
  Top 0.254: U1.26 12.06,74.93 26.04,60.96 53.02,60.96 54.45,62.39 75.41,62.39 76.83,60.96 79.69,60.96 84.14,56.52 86.04,56.52 87.47,55.09 90.01,55.09 90.01,53.82 91.6,52.23 X1.36
P0_3  (via drill 0.61)
  Top 0.254: v89.69,58.26 90.01,58.26 90.01,56.52 91.6,54.93 X1.35 | v83.98,63.98 74.14,63.98 73.18,64.93 54.13,64.93 52.7,63.5 25.4,63.5 U1.28
  Bottom 0.254: v83.98,63.98 v89.69,58.26
P0_4  (via drill 0.61)
  Top 0.254: v77.47,61.91 83.34,61.91 88.9,56.36 X1.18 | v74.45,64.93 73.98,65.41 53.34,65.41 52.7,66.04 25.24,66.04 16.51,74.77 U1.30
  Bottom 0.254: v74.45,64.93 v77.47,61.91
P0_5  (via drill 0.61)
  Top 0.254: v82.39,80.01 76.36,86.04 76.36,88.74 75.72,88.74 73.34,91.12 72.07,91.12 71.6,91.6 60.48,91.6 60.17,91.28 55.4,91.28 v52.55,88.42
  Bottom 0.254: v82.39,80.01 82.39,77.47 91.92,67.94 91.92,57.94 91.76,57.78 X1.34 | v52.55,88.42 23.97,88.42 23.97,82.07 26.83,79.22 33.02,79.22 33.02,76.83 32.38,76.2 19.05,76.2 U1.32
P1_0  (via drill 0.61)
  Top 0.254: v76.99,44.77 77.63,45.4 84.93,45.4 86.04,46.51 X1.5 | v63.66,34.13 v73.5,34.13 | v60.8,34.61 60.17,35.24 v53.98,35.24 | v53.82,39.53 52.7,40.64 29.37,40.64 18.89,51.12 v16.35,51.12
  Bottom 0.254: v76.99,44.77 73.5,41.27 v73.5,34.13 | v63.66,34.13 63.02,33.5 63.02,33.34 62.87,33.18 60.8,33.18 v60.8,34.61 | v53.98,35.24 53.82,35.4 v53.82,39.53 | v16.35,51.12 14.13,53.34 14.13,72.87 12.7,74.3 12.7,78.11 12.06,78.74 6.35,78.74 U1.23
P1_1  (via drill 0.61)
  Top 0.254: v92.87,5.4 95.73,2.54 95.73,1.27 86.2,1.27 85.57,1.91 85.57,2.38 84.93,3.02 84.3,3.02 83.03,1.75 36.99,1.75 v32.23,6.51
  Bottom 0.254: v92.87,5.4 92.87,17.46 91.6,17.46 90.65,18.41 90.65,40.32 90.17,40.8 90.17,46.67 88.9,47.94 X1.21 | v32.23,6.51 29.05,9.68 29.05,63.02 17.78,74.3 17.78,78.11 16.67,79.22 5.08,79.22 5.08,76.83 5.71,76.2 8.89,76.2 U1.25
P1_2  (via drill 0.61)
  Top 0.254: v87.15,40.01 86.68,39.53 80.96,39.53 76.52,35.08 62.55,35.08 61.12,33.66 53.34,33.66 52.7,33.02 46.83,33.02 44.61,30.8 v10.79,30.8
  Bottom 0.254: v87.15,40.01 87.15,48.26 86.2,49.21 X1.4 | v10.79,30.8 10.16,31.43 10.16,76.2 U1.27
P1_3  (via drill 0.61)
  Top 0.254: v15.24,53.5 15.72,53.02 37.62,53.02 v38.1,53.5 | v37.31,2.7 37.31,2.22 82.71,2.22 83.98,3.49 85.25,3.49 86.04,2.7 86.04,2.22 86.52,1.75 94.3,1.75 v94.77,2.22 | v96.84,32.86 97.79,33.81 97.79,46.2 v94.61,46.2 | v94.61,50.8 88.9,50.8 X1.20
  Bottom 0.254: U1.29 13.97,76.52 14.29,76.2 14.76,76.2 14.76,76.04 15.24,75.56 v15.24,53.5 | v38.1,53.5 38.1,49.05 39.05,48.1 39.05,34.61 38.58,34.13 38.58,21.75 37.62,20.8 37.62,18.73 38.1,18.26 38.1,3.97 37.31,3.17 v37.31,2.7 | v94.77,2.22 94.3,2.22 94.3,6.19 95.09,6.99 95.09,8.57 94.61,9.05 94.61,10.79 94.14,11.27 94.14,27.78 94.46,28.1 95.41,28.1 97.31,30 97.31,32.7 97.16,32.86 v96.84,32.86 | v94.61,50.8 v94.61,46.2
P1_4  (via drill 0.61)
  Top 0.254: v72.87,92.08 61.91,92.08 v61.44,92.55 | v58.9,81.28 57.94,80.33 v49.21,80.33 | v48.26,73.82 47.62,73.18 18.89,73.18 17.78,74.3 17.78,77.47 U1.31
  Bottom 0.254: v72.87,92.08 72.87,95.89 81.76,95.89 82.64,95.25 82.64,92.9 83.66,90.49 83.66,84.77 81.44,82.55 81.44,74.61 82.87,73.31 82.87,63.31 87.15,59.53 87.15,53.18 86.2,52.23 X1.3 | v61.44,92.55 58.9,92.55 v58.9,81.28 | v49.21,80.33 48.26,79.38 v48.26,73.82
P1_5  (via drill 0.61)
  Top 0.254: v80.64,58.74 85.72,53.66 88.74,53.66 X1.19 | v74.14,92.08 73.18,93.03 v63.18,93.03 | v59.85,82.87 59.21,82.23 48.42,82.23 44.93,78.74 41.27,78.74 40.64,78.11 40.64,73.66 20.95,73.66 20.32,74.3 20.32,77.47 U1.33
  Bottom 0.254: 80.33,59.05 v80.64,58.74 80.64,67.82 80.01,68.45 80.01,86.14 79.95,86.14 v74.14,92.08 | v63.18,93.03 61.12,90.96 59.53,90.96 59.53,83.19 v59.85,82.87